# EAGLE schematic pulseGeneratorArduinoV1.1 (EAGLE 7.2.0)
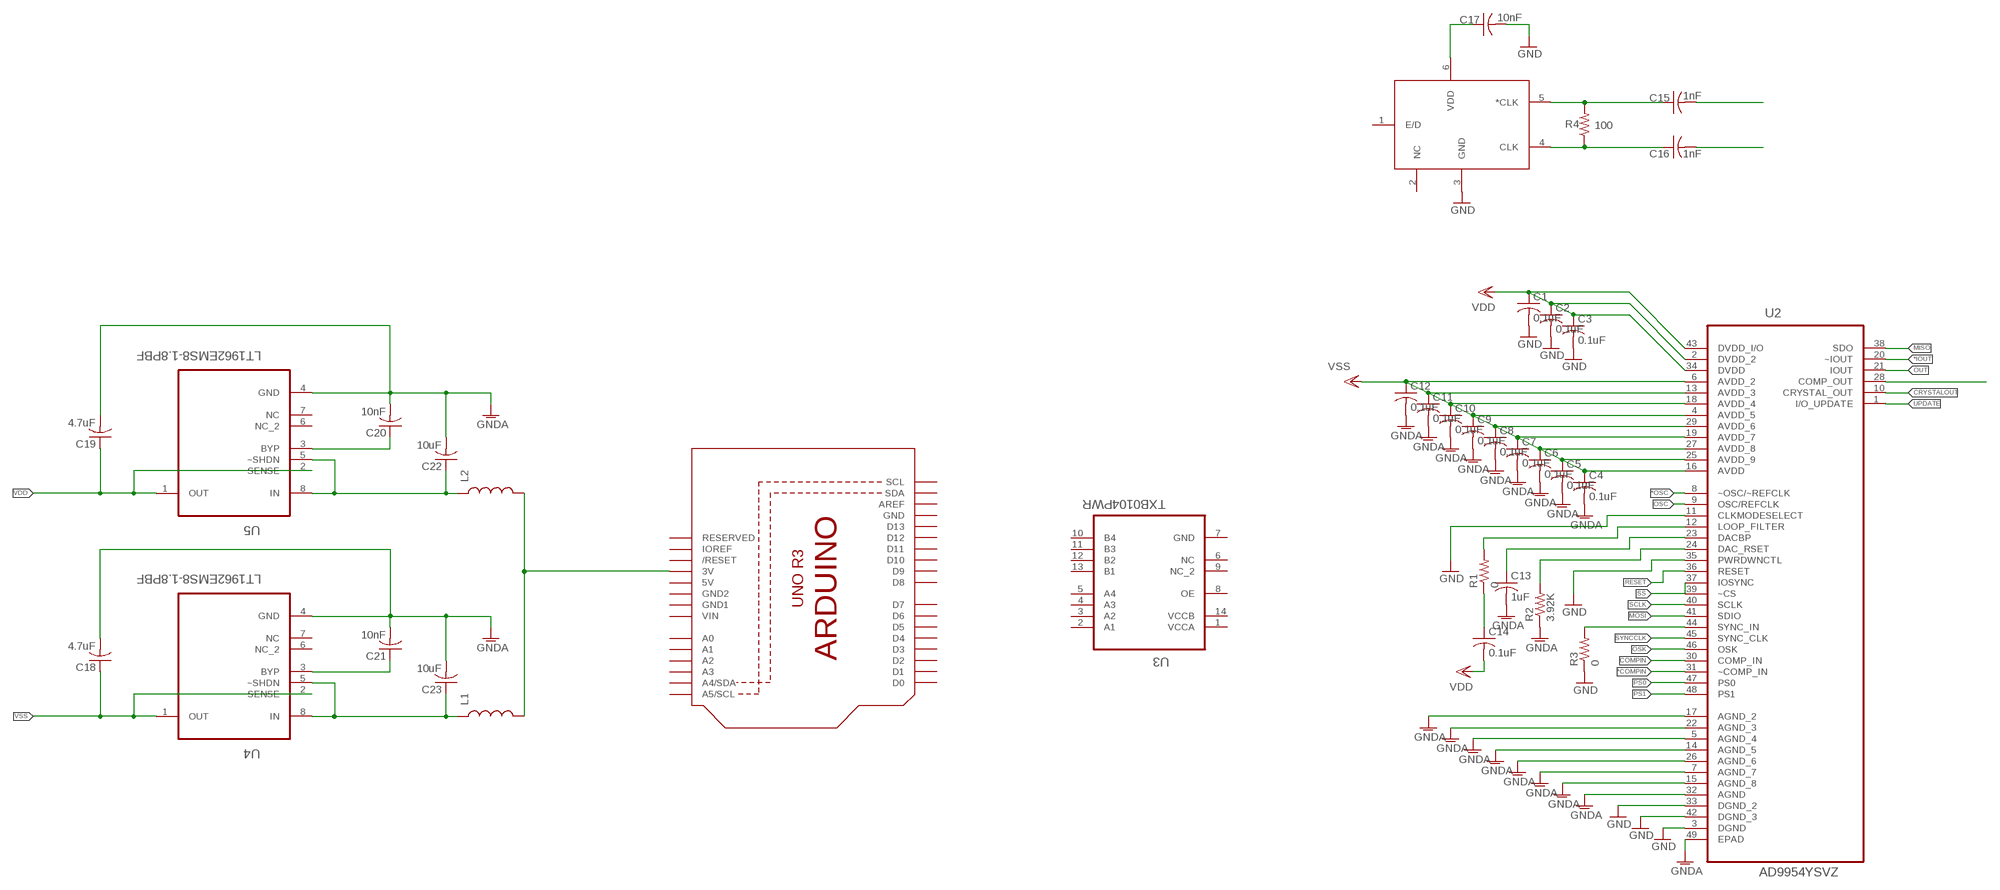
[diagram p0: schematic, sheet 1]

## Parts
C1  0.1uF  C-USC0402  [C0402]
C2  0.1uF  C-USC0402  [C0402]
C3  0.1uF  C-USC0402  [C0402]
C4  0.1uF  C-USC0402  [C0402]
C5  0.1uF  C-USC0402  [C0402]
C6  0.1uF  C-USC0402  [C0402]
C7  0.1uF  C-USC0402  [C0402]
C8  0.1uF  C-USC0402  [C0402]
C9  0.1uF  C-USC0402  [C0402]
C10  0.1uF  C-USC0402  [C0402]
C11  0.1uF  C-USC0402  [C0402]
C12  0.1uF  C-USC0402  [C0402]
C13  1uF  C-USC0402  [C0402]
C14  0.1uF  C-USC0402  [C0402]
C15  1nF  C-USC0402  [C0402]
C16  1nF  C-USC0402  [C0402]
C17  10nF  C-USC0402  [C0402]
C18  4.7uF  C-USC0402  [C0402]
C19  4.7uF  C-USC0402  [C0402]
C20  10nF  C-USC0402  [C0402]
C21  10nF  C-USC0402  [C0402]
C22  10uF  C-USC0402  [C0402]
C23  10uF  C-USC0402  [C0402]
L1  INDUCTOR0603  [0603]
L2  INDUCTOR0603  [0603]
R1  0  R-US_R0402  [R0402]
R2  3.92K  R-US_R0402  [R0402]
R3  0  R-US_R0402  [R0402]
R4  100  R-US_R0402  [R0402]
U1  ARDUINOR3-DIMENSION  [ARDUINOR3]
U2  AD9954YSVZ  [QFP50P900X900X120-49N]
U3  TXB0104PWR  [SOP65P640X120-14N]
U4  LT1962EMS8-1.8PBF  [SOP65P490X110-8N]
U5  LT1962EMS8-1.8PBF  [SOP65P490X110-8N]
U$1  FXO-LC53-100  [6-SMD-NOLEADS]

## Nets
*COMPIN: U2.31(~COMP_IN)
*IOUT: U2.20(~IOUT)
*OSC: C15.2 U2.8(~OSC/~REFCLK)
COMPIN: U2.30(COMP_IN)
CRYSTALOUT: U2.10(CRYSTAL_OUT)
GND: C1.2 C2.2 C3.2 C17.2 R3.1 U2.3(DGND) U2.11(CLKMODESELECT) U2.33(DGND_2) U2.35(PWRDWNCTL) U2.42(DGND_3) U$1.3(GND)
GNDA: C4.2 C5.2 C6.2 C7.2 C8.2 C9.2 C10.2 C11.2 C12.2 C13.2 C18.2 C19.2 C20.2 C21.2 C22.2 C23.2 R2.1 U2.5(AGND_4) U2.7(AGND_7) U2.14(AGND_5) U2.15(AGND_8) U2.17(AGND_2) U2.22(AGND_3) U2.26(AGND_6) U2.32(AGND) U2.49(EPAD) U4.4(GND) U5.4(GND)
MISO: U2.38(SDO)
MOSI: U2.41(SDIO)
N$1: C14.1 R1.1
N$2: C16.1 R4.1 U$1.4(CLK)
N$3: R3.2 U2.44(SYNC_IN)
N$5: C15.1 R4.2 U$1.5(*CLK)
N$6: R1.2 U2.12(LOOP_FILTER)
N$7: C13.1 U2.23(DACBP)
N$8: R2.2 U2.24(DAC_RSET)
N$9: U2.28(COMP_OUT)
N$11: C17.1 U$1.6(VDD)
N$12: C22.1 L2.1 U5.5(~SHDN) U5.8(IN)
N$13: C23.1 L1.1 U4.5(~SHDN) U4.8(IN)
N$14: C20.1 U5.3(BYP)
N$15: C21.1 U4.3(BYP)
N$18: L1.2 L2.2 U1.3V
OSC: C16.2 U2.9(OSC/REFCLK)
OSK: U2.46(OSK)
OUT: U2.21(IOUT)
PS0: U2.47(PS0)
PS1: U2.48(PS1)
RESET: U2.36(RESET)
SCLK: U2.40(SCLK)
SS: U2.37(IOSYNC) U2.39(~CS)
SYNCCLK: U2.45(SYNC_CLK)
UPDATE: U2.1(I/O_UPDATE)
VDD: C1.1 C2.1 C3.1 C14.2 C19.1 U2.2(DVDD_2) U2.34(DVDD) U2.43(DVDD_I/O) U5.1(OUT) U5.2(SENSE)
VSS: C4.1 C5.1 C6.1 C7.1 C8.1 C9.1 C10.1 C11.1 C12.1 C18.1 U2.4(AVDD_5) U2.6(AVDD_2) U2.13(AVDD_3) U2.16(AVDD) U2.18(AVDD_4) U2.19(AVDD_7) U2.25(AVDD_9) U2.27(AVDD_8) U2.29(AVDD_6) U4.1(OUT) U4.2(SENSE)
Unconnected: U1.A0 U1.A1 U1.A2 U1.A3 U1.A4(A4/SDA) U1.A5(A5/SCL) U1.AREF U1.D0 U1.D1 U1.D2 U1.D3 U1.D4 U1.D5 U1.D6 U1.D7 U1.D8 U1.D9 U1.D10 U1.D11 U1.D12 U1.D13 U1.IOREF U1.RESERVED U1.RESET(/RESET) U1.SCL U1.SDA U3.2(A1) U3.3(A2) U3.4(A3) U3.5(A4) U3.6(NC) U3.7(GND) U3.8(OE) U3.9(NC_2) U3.10(B4) U3.11(B3) U3.12(B2) U3.13(B1) U4.6(NC_2) U4.7(NC) U5.6(NC_2) U5.7(NC) U$1.1(E/D) U$1.2(NC)

## Power pins joined to a net without a drawn wire
5V: U1.5V
GND: U1.GND
GND1: U1.GND1
GND2: U1.GND2
VCCA: U3.1(VCCA)
VCCB: U3.14(VCCB)
VIN: U1.VIN

## Library data of the parts
C1-C23 = resistor:C-US: CAPACITOR, American symbol
L1 L2 = SparkFun-Passives:INDUCTOR: Inductors Basic Inductor/Choke - 0603 and 1206. Footprints are not proven and vary greatly between part numbers. SRN6045- 33uH, 20% 1.4A SDR0403-560KL - 56uH, 10%, 500mA RMS/740mA peak
R1-R4 = resistor:R-US_: RESISTOR, American symbol
U1 = adafruit:ARDUINOR3: This is a new object for the new Arduino R3 - with extra pins that you may want to use (such as IOref, and duplicated A4/A5
U2 = Analog Devices_By_element14_Batch_1:AD9954YSVZ: Direct Digital Synthesizer; MPN: AD9954YSVZ; OC_FARNELL: 1581969; OC_NEWARK: 19M8953; PACKAGE: TQFP-48; SUPPLIER: ANALOG DEVICES
U3 = Texas Instruments_By_element14_Batch_1:TXB0104PWR: 4-BIT BIDIRECTIONAL VOLTAGE-LEVEL TRANSLATOR; MPN: TXB0104PWR; OC_FARNELL: 1607891; OC_NEWARK: 99K4466; PACKAGE: TSSOP-14; SUPPLIER: Texas Instruments
U4 U5 = LTC_By_element14_Batch_1:LT1962EMS8-1.8PBF: Micropower LDO Regulators; MPN: LT1962EMS8-1.8#PBF; OC_FARNELL: 1627579; OC_NEWARK: 57M7385; PACKAGE: MSOP-8; SUPPLIER: Linear Technologies
U$1 = FXO-LC53-100:FXO-LC53-100